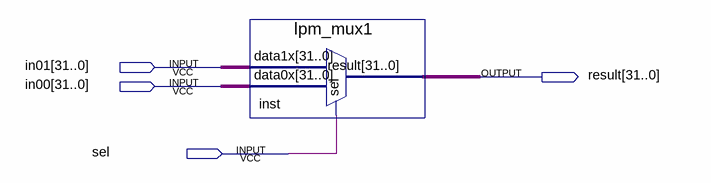
[diagram p0: schematic sheet]
// Quartus schematic MUX_32.bdf as structural Verilog: 1 symbols, 4 pins
module MUX_32 (
  input  [31:0] in01,
  input  [31:0] in00,
  input  sel,
  output [31:0] result
);

  lpm_mux1 inst (.data1x(in01), .data0x(in00), .sel(sel), .result(result));
endmodule
